# EAGLE design BuckModuleTest (EAGLE 9.6.2)
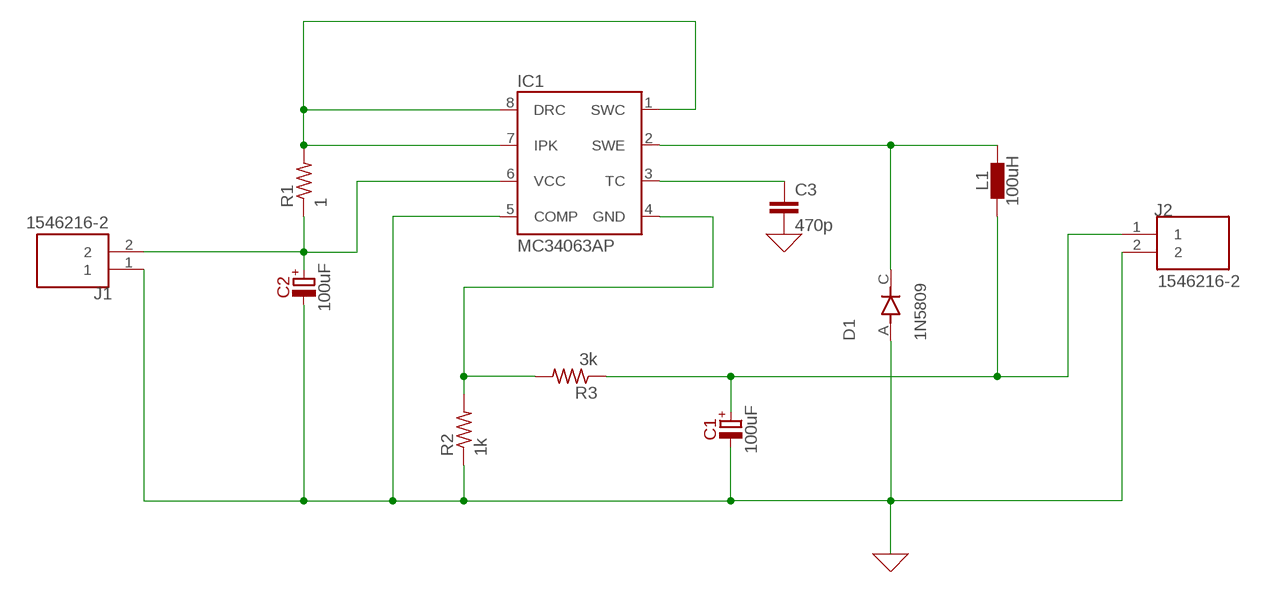
[diagram p0: schematic, sheet 1]

## Parts
C1  100uF  1U/50V  [E1,5-4]
C2  100uF  1U/50V  [E1,5-4]
C3  470p  C2.5/2  [C2.5-2]
D1  1N5809  1N4007  [DIOAD1060W80L520D270]
IC1  MC34063AP  [DIL-08]
J1  1546216-2  [TE_1546216-2]
J2  1546216-2  [TE_1546216-2]
L1  100uH  INDUCTOR-NR80XX  [L_NR80XX]
R1  1  R-US_0207/12  [0207/12]
R2  1k  R-US_0207/12  [0207/12]
R3  3k  R-US_0207/12  [0207/12]

## Nets
0: C1.- C2.- C3.2 D1.A IC1.5(COMP) J1.1 J2.2 R2.1 ; supply symbol labelled GND
N$1: IC1.1(SWC) IC1.7(IPK) IC1.8(DRC) R1.2
N$2: D1.C IC1.2(SWE) L1.2
N$3: C3.1 IC1.3(TC)
N$4: IC1.4(GND) R2.2 R3.2
N$5: C1.+ J2.1 L1.1 R3.1
N$7: C2.+ IC1.6(VCC) J1.2 R1.1

## Library data of the parts
C1 C2 = capacitors-electrolytic:?; MOUSER: 647-USW1H010MDD
C3 = capacitor-wima:C: CAPACITOR naming: grid - package width
D1 = 1N4007:1N4007: Diode Switching 1KV 1A 2-Pin DO-41 Check availability <https://pricing.snapeda.com/parts/1N4007/ON%20Semiconductor/view-part?ref=eda>; AVAILABILITY: In Stock; DESCRIPTION: Diode Standard 1000V 1A Through Hole DO-204AL (DO-41); MF: ON Semiconductor; MP: 1N4007; PACKAGE: DO-41-2 ON Semiconductor; PRICE: None; PURCHASE-URL: https://pricing.snapeda.com/search/part/1N4007/?ref=eda
IC1 = MC34063A:MC34063A: 1.5A Step-Up/Down/Inverting Switching Regulator NPN Darlington Switch, Vin 3V to 40V, Current Limiter Input, adjustable Frequency up to 100kHz Check availability <https://pricing.snapeda.com/parts/MC34063A/Texas%20Instruments/view-part?ref=eda>; AVAILABILITY: In Stock; DESCRIPTION: Buck, Boost Switching Regulator IC Positive or Negative Adjustable 1.25V 1 Output 1.5A (Switch) 8-SOIC (0.154, 3.90mm Width); MF: Texas Instruments; MP: MC34063A; PACKAGE: SOIC-8 Texas Instruments; PRICE: None; PURCHASE-URL: https://pricing.snapeda.com/search/part/MC34063A/?ref=eda
J1 J2 = terminal-block-2p:1546216-2: Check availability <https://pricing.snapeda.com/parts/1546216-2/TE%20Connectivity/view-part?ref=eda>; AVAILABILITY: In Stock; CENTERLINE_PITCH: 5 mm[.197 in]; COMMENT: 1546216-2; DESCRIPTION: TERMI-BLOK PCB MOUNT 90 2P.; EU_ROHS_COMPLIANCE: Compliant with Exemptions; MF: TE Connectivity; MP: 1546216-2; NUMBER_OF_POSITIONS: 2; PACKAGE: None; PRICE: None; PURCHASE-URL: https://pricing.snapeda.com/search/part/1546216-2/?ref=eda
L1 = we-power:INDUCTOR: Power Inductor Taiyo Yuden NRxxxx are compatible with FerroCore DJNRxxxx and YJYCOIN YNRxxxx. 4x4mm - Taiyo Yuden NR4018 / DJNR4018 / YNR4018 NR4018T1R0N - 1.0uH, Ir=4.0A NR4018T2R2N - 2.2uH, Ir=2.7A NR4018T3R3N - 3.3uH, Ir=2.0A NR4018T4R5N - 4.7uH, Ir=1.7A NR4018T6R8N - 6.8uH, Ir=1.4A NR4018T100M - 10uH, Ir=1.2A NR4018T150M - 15uH, Ir=0.94A NR4018T220M - 22uH, Ir=0.80A NR4018T330M - 33uH, Ir=0.65A NR4018T470M - 47uH, Ir=0.57A NR4018T680M - 68uH, Ir=0.47A NR4018T101M - 100uH, Ir=0.40A 6x6mm - Taiyo Yuden NR6028 / DJNR6028 / YNR6028 NR6028T0R9N - 0.9uH, Ir=6.6A NR6028T1R5N - 1.5uH, Ir=5.0A NR6028T2R2N - 2.2uH, Ir=4.2A NR6028T3R0N - 3.0uH, Ir=3.6A NR6028T4R7M - 4.7uH, Ir=2.7A NR6028T6R0M - 6.0uH, Ir=2.5A NR6028T100M - 10uH, Ir=1.9A NR6028T150M - 15uH, Ir=1.6A NR6028T220M - 22uH, Ir=1.3A NR6028T330M - 33uH, Ir=1.1A NR6028T470M - 47uH, Ir=0.95A NR6028T680M - 68uH, Ir=0.76A NR6028T101M - 100uH, Ir=0.62A 6x6mm - Taiyo Yuden NR6045 / DJNR6045 / YNR6045 NR6045T1R0N - 1.0uH, Ir=8.5A NR6045T1R3N - 1.3uH, Ir=8.0A NR6045T1R8N - 1.8uH, Ir=7.0A NR6045T2R3N - 2.3uH, Ir=6.0A NR6045T3R0N - 3.0uH, Ir=5.0A NR6045T4R5M - 4.5uH, Ir=4.0A NR6045T6R3M - 6.3uH, Ir=3.8A NR6045T100M - 10uH, Ir=3.0A NR6045T150M - 15uH, Ir=2.3A NR6045T220M - 22uH, Ir=1.9A NR6045T330M - 33uH, Ir=1.5A NR6045T470M - 47uH, Ir=1.3A NR6045T680M - 68uH, Ir=1.0A NR6045T101M - 100uH, Ir=0.8A 8x8mm - Taiyo Yuden NR8040 / DJNR8040 / YNR8040
R1-R3 = resistor:R-US_: RESISTOR, American symbol

## Board
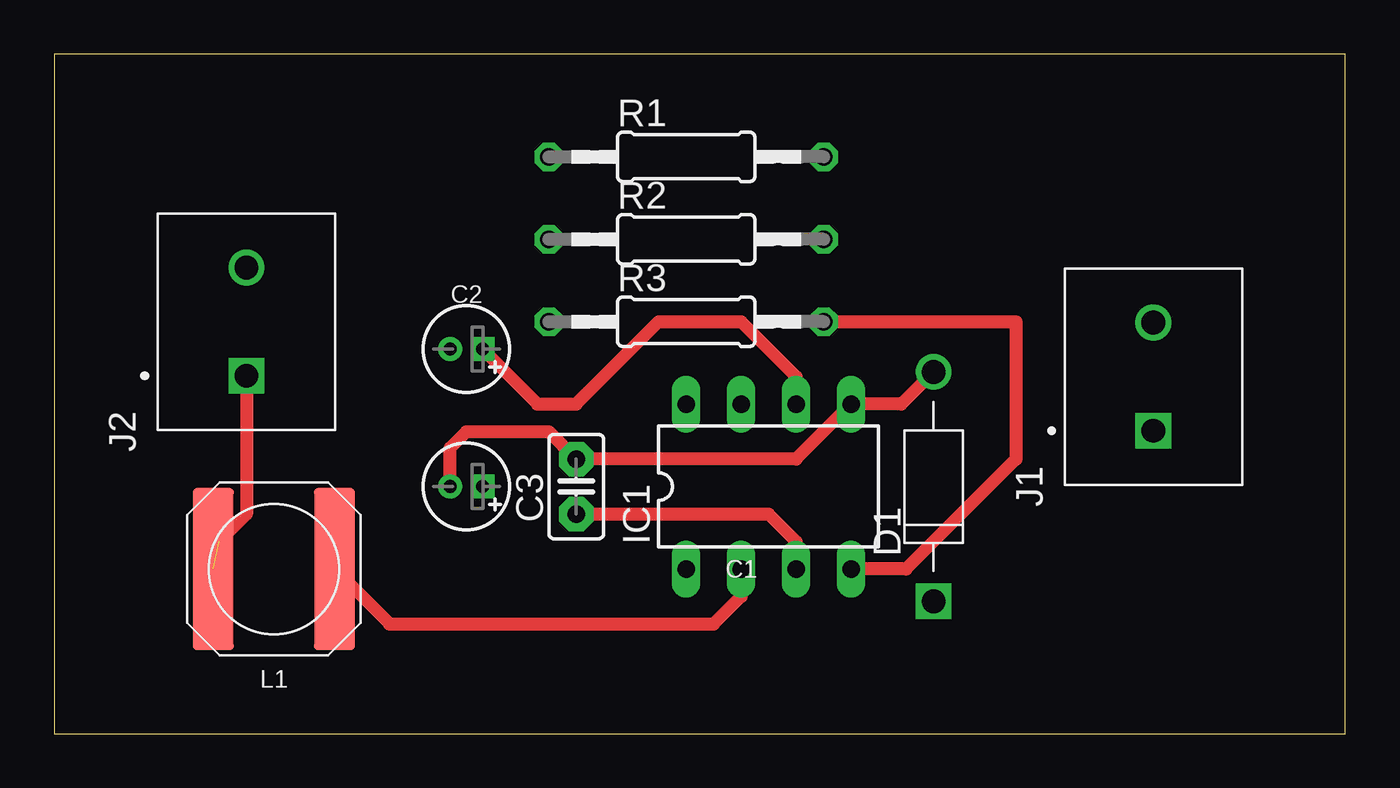
[diagram p1: board, top side]
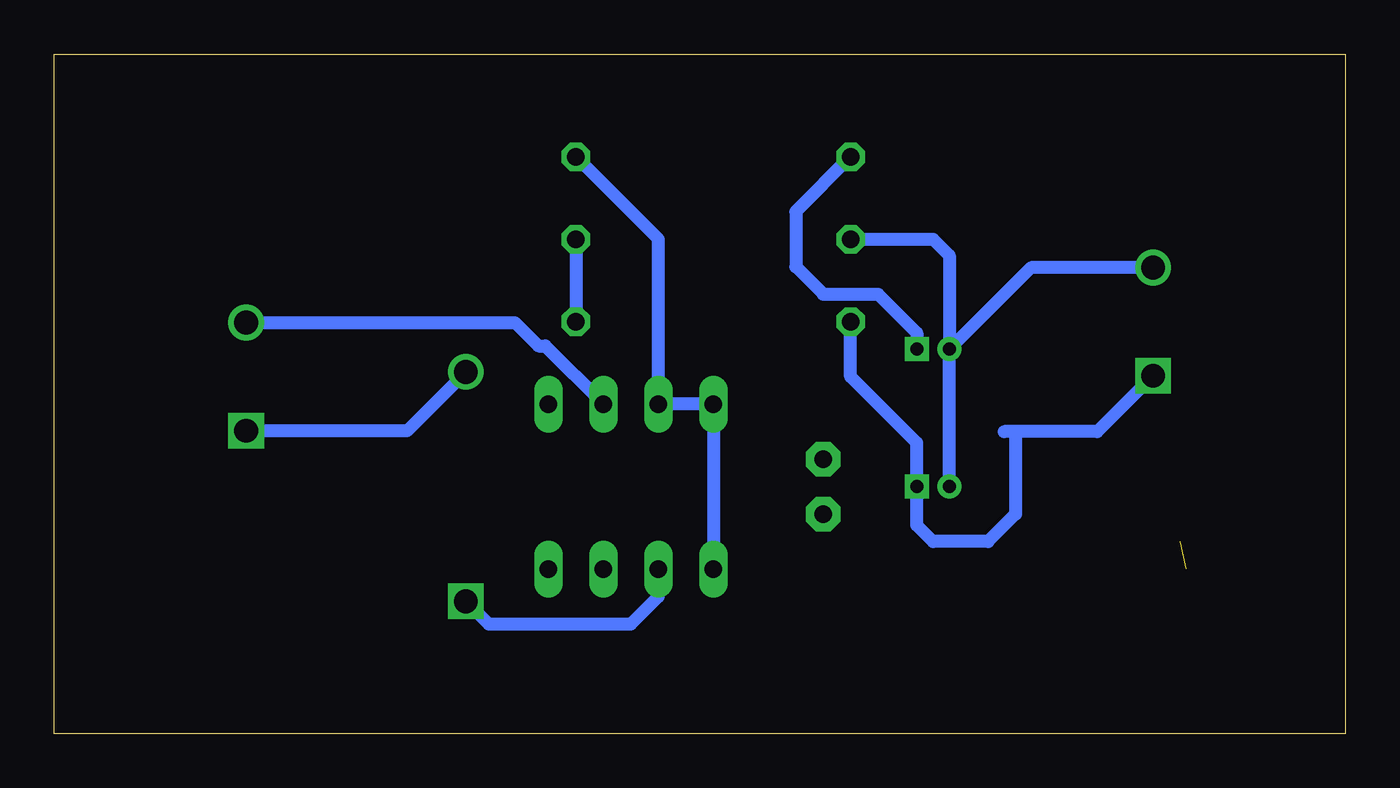
[diagram p2: board, bottom side, seen from below]

Size 59.67 x 31.42 mm. Coordinates in mm from the lower left corner, seen from the top.
Outline: 0,0 59.67,0 59.67,31.42 0,31.42 0,0
Copper layers (1*16): Top 0.035mm / dielectric 1.5mm / Bottom 0.035mm
Design rules "default": minimum track width 6mil, minimum drill 0.35mm, track to track 6mil, track to pad 6mil, pad to pad 6mil, via to via 6mil, smd to smd 6mil, copper to edge 40mil, drill to drill 6mil, minimum pad ring 10mil, minimum via ring 8mil, stop-mask expansion 4mil, vias tented up to drill 0mil, thermal gap 10mil

### Footprints (pad centres in the part's own frame; a part is rotated, then mirrored left to right if it is on the bottom)
E1,5-4 = drill 0.6 square: + -0.75,0 | drill 0.6: - 0.75,0
C2.5-2 = drill 0.813 pad 1.6 octagon: 1 -1.27,0; 2 1.27,0
DIOAD1060W80L520D270 = drill 1.1 pad 1.65: A 5.3,0 | drill 1.1 pad 1.65 square: C -5.3,0
DIL-08 = drill 0.813 long: 1 -3.81,-3.81; 2 -1.27,-3.81; 3 1.27,-3.81; 4 3.81,-3.81; 5 3.81,3.81; 6 1.27,3.81; 7 -1.27,3.81; 8 -3.81,3.81
TE_1546216-2 = drill 1.1 square: 1 -2.5,0 | drill 1.1: 2 2.5,0
L_NR80XX = smd 7.5 x 1.9: 1 0,2.8; 2 0,-2.8
0207/12 = drill 0.813 octagon: 1 -6.35,0; 2 6.35,0

### Placement (x,y rotation side)
C1  19.05,11.43 180 top
C2  19.05,17.78 180 top
C3  24.13,11.43 90 top
D1  40.64,11.43 90 top
IC1  33.02,11.43 0 top
J1  50.8,16.51 90 top
J2  8.89,19.05 90 top
L1  10.16,7.62 90 top
R1  29.21,26.67 0 top
R2  29.21,22.86 0 top
R3  29.21,19.05 0 top

### Tracks (layer width: path | path; a pad name or v marks a point on that pad's centre or on a via)
0
  Top 0.61: D1.A 39.15,15.24 IC1.5 34.29,12.7 C3.2 22.86,13.97 19.05,13.97 18.3,13.22 C1.-
  Bottom 0.61: C1.- C2.- | R2.1 19.05,22.86 18.3,22.11 C2.- | J2.2 14.53,21.55 C2.- | D1.A 43.36,14.01 J1.1
N$1
  Bottom 0.61: IC1.1 IC1.8 IC1.7 31.75,22.86 R1.2
N$2
  Top 0.61: L1.2 15.5,5.08 30.48,5.08 31.75,6.35 IC1.2
  Bottom 0.61: D1.C 39.59,5.08 33.02,5.08 31.75,6.35 IC1.2
N$3
  Top 0.61: C3.1 33.02,10.16 34.29,8.89 IC1.3
N$4
  Top 0.61: R3.2 44.45,19.05 44.45,12.7 39.37,7.62 IC1.4
  Bottom 0.61: R2.2 R3.2
N$5  (1 unrouted)
  Top 0.61: J2.1 8.89,10.16 7.62,8.89
  Bottom 0.61: J2.1 11.47,13.97 15.24,13.97 | 15.24,13.97 15.76,13.97 | 15.24,13.97 15.24,10.16 16.51,8.89 19.05,8.89 19.8,9.64 C1.+ 19.8,13.45 22.86,16.51 R3.1
N$7
  Top 0.61: C2.+ 22.34,15.24 24.13,15.24 27.94,19.05 31.75,19.05 34.29,16.51 IC1.6
  Bottom 0.61: IC1.6 36.98,17.93 37.29,17.93 38.37,19.01 J1.2 | R1.1 25.4,24.13 25.4,21.59 24.13,20.32 21.59,20.32 19.8,18.53 C2.+